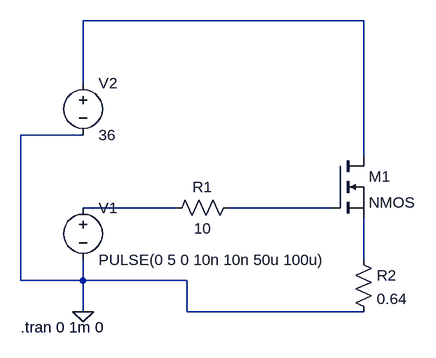
[diagram p0: schematic Draft1.asc]
Draft1.asc, the LTspice schematic file:
Version 4.1
SHEET 1 880 680
WIRE 160 -96 -272 -96
WIRE -272 0 -272 -96
WIRE -272 80 -368 80
WIRE 160 112 160 -96
WIRE -128 192 -272 192
WIRE 112 192 -48 192
WIRE 160 272 160 208
WIRE -368 304 -368 80
WIRE -272 304 -272 272
WIRE -272 304 -368 304
WIRE -112 304 -272 304
WIRE -272 352 -272 304
WIRE -112 352 -112 304
WIRE 160 352 -112 352
FLAG -272 352 0
SYMBOL nmos 112 112 R0
SYMATTR InstName M1
SYMBOL voltage -272 176 R0
WINDOW 123 0 0 Left 0
WINDOW 39 0 0 Left 0
SYMATTR InstName V1
SYMATTR Value PULSE(0 5 0 10n 10n 50u 100u)
SYMBOL voltage -272 -16 R0
WINDOW 123 0 0 Left 0
WINDOW 39 0 0 Left 0
SYMATTR InstName V2
SYMATTR Value 36
SYMBOL res -32 176 R90
WINDOW 0 0 56 VBottom 2
WINDOW 3 32 56 VTop 2
SYMATTR InstName R1
SYMATTR Value 10
SYMBOL res 144 256 R0
SYMATTR InstName R2
SYMATTR Value 0.64
TEXT -368 376 Left 2 !.tran 0 1m 0

The netlist it stands for:
* Draft1.asc
M1 N001 N003 N004 N004 NMOS
V1 N002 0 PULSE(0 5 0 10n 10n 50u 100u)
V2 N001 0 36
R1 N003 N002 10
R2 N004 0 0.64
.model NMOS NMOS
.model PMOS PMOS
.lib standard.mos
.tran 0 1m 0
.backanno
.end